# Altium schematic sheet Relay schematic.SchDoc
size A4; Date: 24/10; Author: Rami Abdelmotalib; DocumentName: Relay circuit
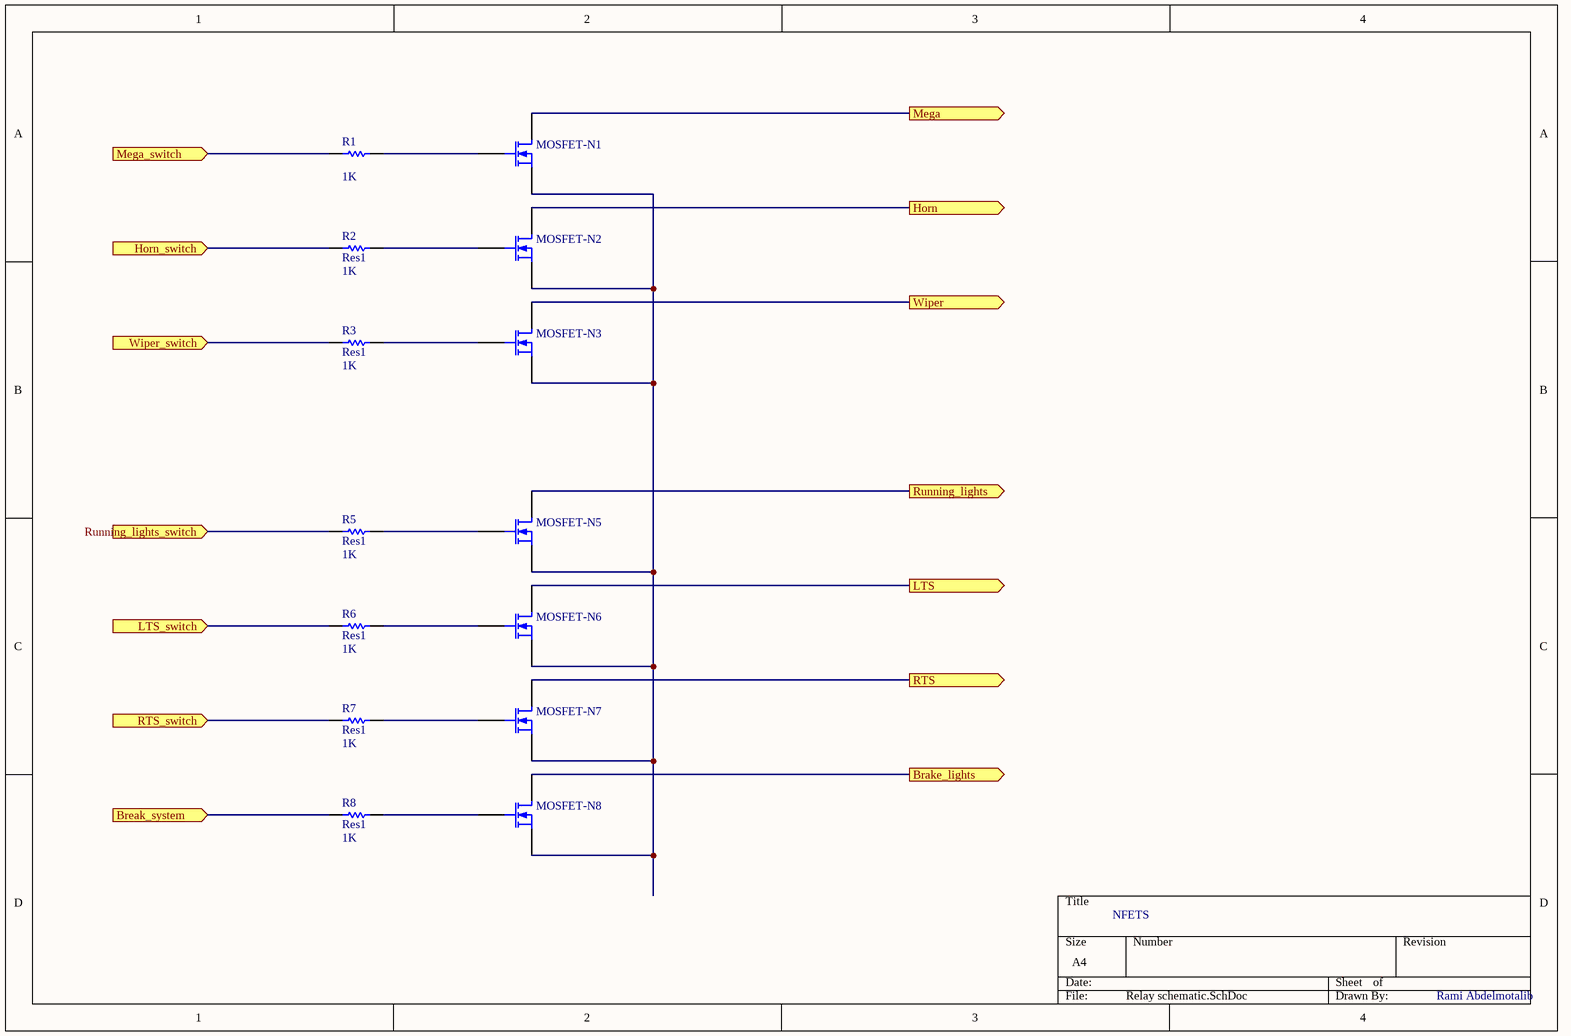
[diagram p0: Relay schematic.SchDoc]

## Parts
MOSFET-N1  (no value)  [E3]
MOSFET-N2  (no value)  [E3]
MOSFET-N3  (no value)  [E3]
MOSFET-N5  (no value)  [E3]
MOSFET-N6  (no value)  [E3]
MOSFET-N7  (no value)  [E3]
MOSFET-N8  (no value)  [E3]
R1  value 1K  [AXIAL-0.3]
R2  Res1  value 1K  [AXIAL-0.3]
R3  Res1  value 1K  [AXIAL-0.3]
R5  Res1  value 1K  [AXIAL-0.3]
R6  Res1  value 1K  [AXIAL-0.3]
R7  Res1  value 1K  [AXIAL-0.3]
R8  Res1  value 1K  [AXIAL-0.3]

## Ports
Brake_lights (out), Break_system (in), Horn (out), Horn_switch (in), LTS (out), LTS_switch (in), Mega (out), Mega_switch (in), RTS (out), RTS_switch (in), Running_lights (out), Running_lights_switch (in), Wiper (out), Wiper_switch (in)

## Nets
Brake_lights: MOSFET-N8.1(D) ; port Brake_lights
Break_system: R8.1 ; port Break_system
Horn: MOSFET-N2.1(D) ; port Horn
Horn_switch: R2.1 ; port Horn_switch
LTS: MOSFET-N6.1(D) ; port LTS
LTS_switch: R6.1 ; port LTS_switch
Mega: MOSFET-N1.1(D) ; port Mega
Mega_switch: R1.1 ; port Mega_switch
RTS: MOSFET-N7.1(D) ; port RTS
RTS_switch: R7.1 ; port RTS_switch
Running_lights: MOSFET-N5.1(D) ; port Running_lights
Running_lights_switch: R5.1 ; port Running_lights_switch
Wiper: MOSFET-N3.1(D) ; port Wiper
Wiper_switch: R3.1 ; port Wiper_switch
NetMOSFET-N1_2: MOSFET-N1.2(G) R1.2
NetMOSFET-N1_3: MOSFET-N1.3(S) MOSFET-N2.3(S) MOSFET-N3.3(S) MOSFET-N5.3(S) MOSFET-N6.3(S) MOSFET-N7.3(S) MOSFET-N8.3(S)
NetMOSFET-N2_2: MOSFET-N2.2(G) R2.2
NetMOSFET-N3_2: MOSFET-N3.2(G) R3.2
NetMOSFET-N5_2: MOSFET-N5.2(G) R5.2
NetMOSFET-N6_2: MOSFET-N6.2(G) R6.2
NetMOSFET-N7_2: MOSFET-N7.2(G) R7.2
NetMOSFET-N8_2: MOSFET-N8.2(G) R8.2

## Notes on the sheet
- NFETS
- Rami Abdelmotalib

## Library data of the parts
MOSFET-N1-MOSFET-N3 MOSFET-N5-MOSFET-N8 = MOSFET-N: N-Channel MOSFET; Published: 8-Jun-2000; LatestRevisionDate: 17-Jul-2002; LatestRevisionNote: Re-released for DXP Platform.; PackageVersion: 1995/1996; PackageReference: E3; Publisher: Altium Limited; PackageDescription: TO, Flat Index; 3 In-Line, Axial Leads; Body Dia. 4.6mm; Lead Dia. 0.5 mm (max)
R1-R3 R5-R8 = Res1: Resistor; Published: 8-Jun-2000; LatestRevisionDate: 17-Jul-2002; LatestRevisionNote: Re-released for DXP Platform.; PackageReference: AXIAL-0.3; Publisher: Altium Limited; PackageDescription: Axial Device, Thru-Hole; 2 Leads; 0.3 in Pin Spacing